# Altium schematic sheet Sheet2.SchDoc
size A3
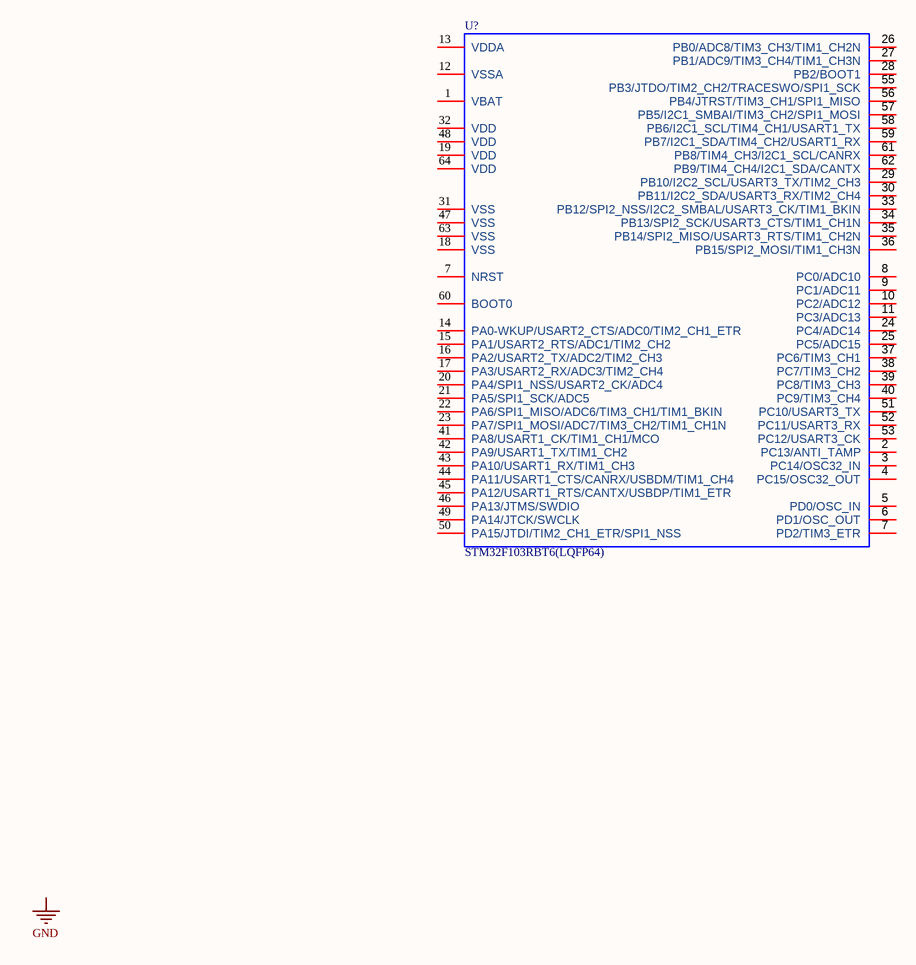
[diagram p0: Sheet2.SchDoc]

## Parts
U?  STM32F103RBT6(LQFP64)  [TQFP64_0.5_10]

## Nets

Not connected (* = marked no-connect by the designer): U? 1(VBAT) 2(PC13/ANTI_TAMP) 3(PC14/OSC32_IN) 4(PC15/OSC32_OUT) 5(PD0/OSC_IN) 6(PD1/OSC_OUT) 7(NRST) 8(PC0/ADC10) 9(PC1/ADC11) 10(PC2/ADC12) 11(PC3/ADC13) 12(VSSA) 13(VDDA) 14(PA0-WKUP/USART2_CTS/ADC0/TIM2_CH1_ETR) 15(PA1/USART2_RTS/ADC1/TIM2_CH2) 16(PA2/USART2_TX/ADC2/TIM2_CH3) 17(PA3/USART2_RX/ADC3/TIM2_CH4) 18(VSS) 19(VDD) 20(PA4/SPI1_NSS/USART2_CK/ADC4) 21(PA5/SPI1_SCK/ADC5) 22(PA6/SPI1_MISO/ADC6/TIM3_CH1/TIM1_BKIN) 23(PA7/SPI1_MOSI/ADC7/TIM3_CH2/TIM1_CH1N) 24(PC4/ADC14) 25(PC5/ADC15) 26(PB0/ADC8/TIM3_CH3/TIM1_CH2N) 27(PB1/ADC9/TIM3_CH4/TIM1_CH3N) 28(PB2/BOOT1) 29(PB10/I2C2_SCL/USART3_TX/TIM2_CH3) 30(PB11/I2C2_SDA/USART3_RX/TIM2_CH4) 31(VSS) 32(VDD) 33(PB12/SPI2_NSS/I2C2_SMBAL/USART3_CK/TIM1_BKIN) 34(PB13/SPI2_SCK/USART3_CTS/TIM1_CH1N) 35(PB14/SPI2_MISO/USART3_RTS/TIM1_CH2N) 36(PB15/SPI2_MOSI/TIM1_CH3N) 37(PC6/TIM3_CH1) 38(PC7/TIM3_CH2) 39(PC8/TIM3_CH3) 40(PC9/TIM3_CH4) 41(PA8/USART1_CK/TIM1_CH1/MCO) 42(PA9/USART1_TX/TIM1_CH2) 43(PA10/USART1_RX/TIM1_CH3) 44(PA11/USART1_CTS/CANRX/USBDM/TIM1_CH4) 45(PA12/USART1_RTS/CANTX/USBDP/TIM1_ETR) 46(PA13/JTMS/SWDIO) 47(VSS) 48(VDD) 49(PA14/JTCK/SWCLK) 50(PA15/JTDI/TIM2_CH1_ETR/SPI1_NSS) 51(PC10/USART3_TX) 52(PC11/USART3_RX) 53(PC12/USART3_CK) 55(PB3/JTDO/TIM2_CH2/TRACESWO/SPI1_SCK) 56(PB4/JTRST/TIM3_CH1/SPI1_MISO) 57(PB5/I2C1_SMBAI/TIM3_CH2/SPI1_MOSI) 58(PB6/I2C1_SCL/TIM4_CH1/USART1_TX) 59(PB7/I2C1_SDA/TIM4_CH2/USART1_RX) 60(BOOT0) 61(PB8/TIM4_CH3/I2C1_SCL/CANRX) 62(PB9/TIM4_CH4/I2C1_SDA/CANTX) 63(VSS) 64(VDD)

## Notes on the sheet
- Labels drawn without touching a wire or pin: GND

## Library data of the parts
U? = STM32F103RBT6: LQFP64